# EAGLE design MosfetV5 (EAGLE 9.3.0)
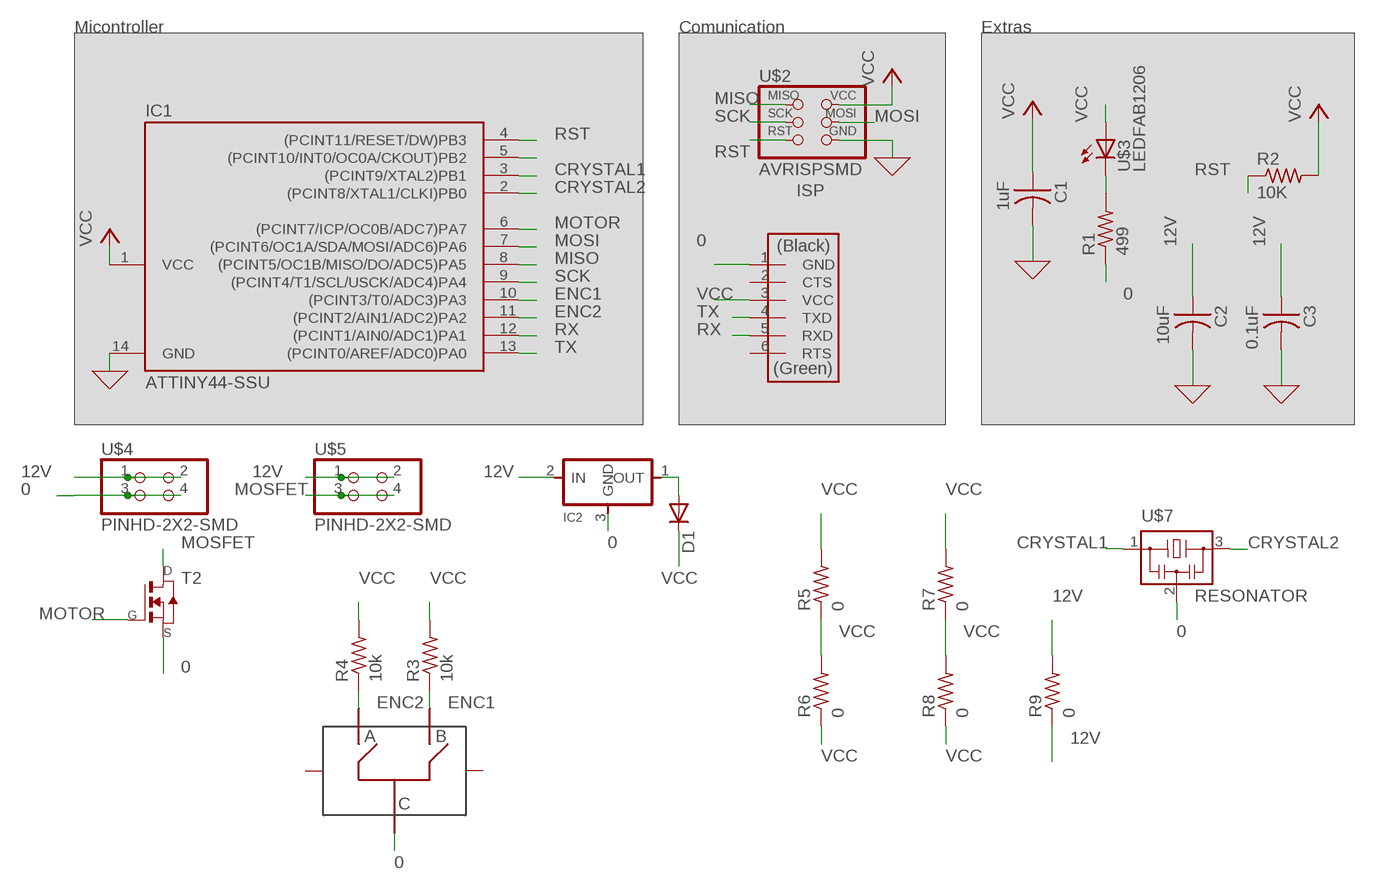
[diagram p0: schematic, sheet 1]

## Parts
C1  1uF  CAP-US1206FAB  [C1206FAB]
C2  10uF  CAP-US1206FAB  [C1206FAB]
C3  0.1uF  CAP-US1206FAB  [C1206FAB]
D1  DIODESOD123  [SOD123]
IC1  ATTINY44-SSU  [SOIC14]
IC2  REGULATORSOT23  [SOT23]
R1  499  RES-US1206FAB  [R1206FAB]
R2  10K  RES-US1206FAB  [R1206FAB]
R3  10k  RES-US1206FAB  [R1206FAB]
R4  10k  RES-US1206FAB  [R1206FAB]
R5  0  RES-US1206FAB  [R1206FAB]
R6  0  RES-US1206FAB  [R1206FAB]
R7  0  RES-US1206FAB  [R1206FAB]
R8  0  RES-US1206FAB  [R1206FAB]
R9  0  RES-US1206FAB  [R1206FAB]
T2  NMOSFETTO252  [TO252]
U$1  FTDI-SMD-HEADER  [1X06SMD]
U$2  AVRISPSMD  [2X03SMD]
U$3  LEDFAB1206  [LED1206FAB]
U$4  PINHD-2X2-SMD  [2X02SMD]
U$5  PINHD-2X2-SMD  [2X02SMD]
U$6  ALBS_ENCODER_STEC12E08  [STEC12E08]
U$7  RESONATOR  [EFOBM]

## Nets
0: C1.2 C2.2 C3.2 IC1.14(GND) IC2.3(GND) R1.1 T2.2(S) U$1.1(GND) U$2.6(GND) U$4.3 U$4.4 U$6.P$C(TERMINAL_C) U$7.2 ; supply symbol labelled GND
12V: C2.1 C3.1 IC2.2(IN) R9.1 R9.2 U$4.1 U$4.2 U$5.1 U$5.2
CRYSTAL1: IC1.3((PCINT9/XTAL2)PB1) U$7.1
CRYSTAL2: IC1.2((PCINT8/XTAL1/CLKI)PB0) U$7.3
ENC1: IC1.10((PCINT3/T0/ADC3)PA3) R3.1 U$6.P$B(TERMINAL_B)
ENC2: IC1.11((PCINT2/AIN1/ADC2)PA2) R4.1 U$6.P$A(TERMINAL_A)
MISO: IC1.8((PCINT5/OC1B/MISO/DO/ADC5)PA5) U$2.1(MISO)
MOSFET: T2.3(D) U$5.3 U$5.4
MOSI: IC1.7((PCINT6/OC1A/SDA/MOSI/ADC6)PA6) U$2.4(MOSI)
MOTOR: IC1.6((PCINT7/ICP/OC0B/ADC7)PA7) T2.1(G)
N$1: R1.2 U$3.2(C)
N$5: IC1.5((PCINT10/INT0/OC0A/CKOUT)PB2)
N$11: D1.ANODE(A) IC2.1(OUT)
RST: IC1.4((PCINT11/RESET/DW)PB3) R2.1 U$2.5(RST)
RX: IC1.12((PCINT1/AIN0/ADC1)PA1) U$1.5(RXD)
SCK: IC1.9((PCINT4/T1/SCL/USCK/ADC4)PA4) U$2.3(SCK)
TX: IC1.13((PCINT0/AREF/ADC0)PA0) U$1.4(TXD)
VCC: C1.1 D1.CATHODE(C) IC1.1(VCC) R2.2 R3.2 R4.2 R5.1 R5.2 R6.1 R6.2 R7.1 R7.2 R8.1 R8.2 U$1.3(VCC) U$2.2(VCC) U$3.1(A)
Unconnected: U$1.2(CTS) U$1.6(RTS) U$6.P$CASE0 U$6.P$CASE1

## Notes on the sheet
- Micontroller | Comunication | Extras
- ISP

## Library data of the parts
C1-C3 = fab:CAP-US
D1 = fab:DIODE: DIODE high speed (Philips)
IC1 = fab:ATTINY44
IC2 = fab:REGULATOR
R1-R9 = fab:RES-US: Resistor (US Symbol) Variants with postfix FAB are widened to allow the routing of internal traces
T2 = fab:NMOSFET: MOS FET
U$1 = fab:FTDI-SMD-HEADER
U$2 = fab:AVRISP
U$3 = fab:LED: LED
U$4 U$5 = fab:PINHD-2X2-SMD
U$6 = Rotary Encoder:ALBS_ENCODER_STEC12E08
U$7 = fab:RESONATOR

## Board
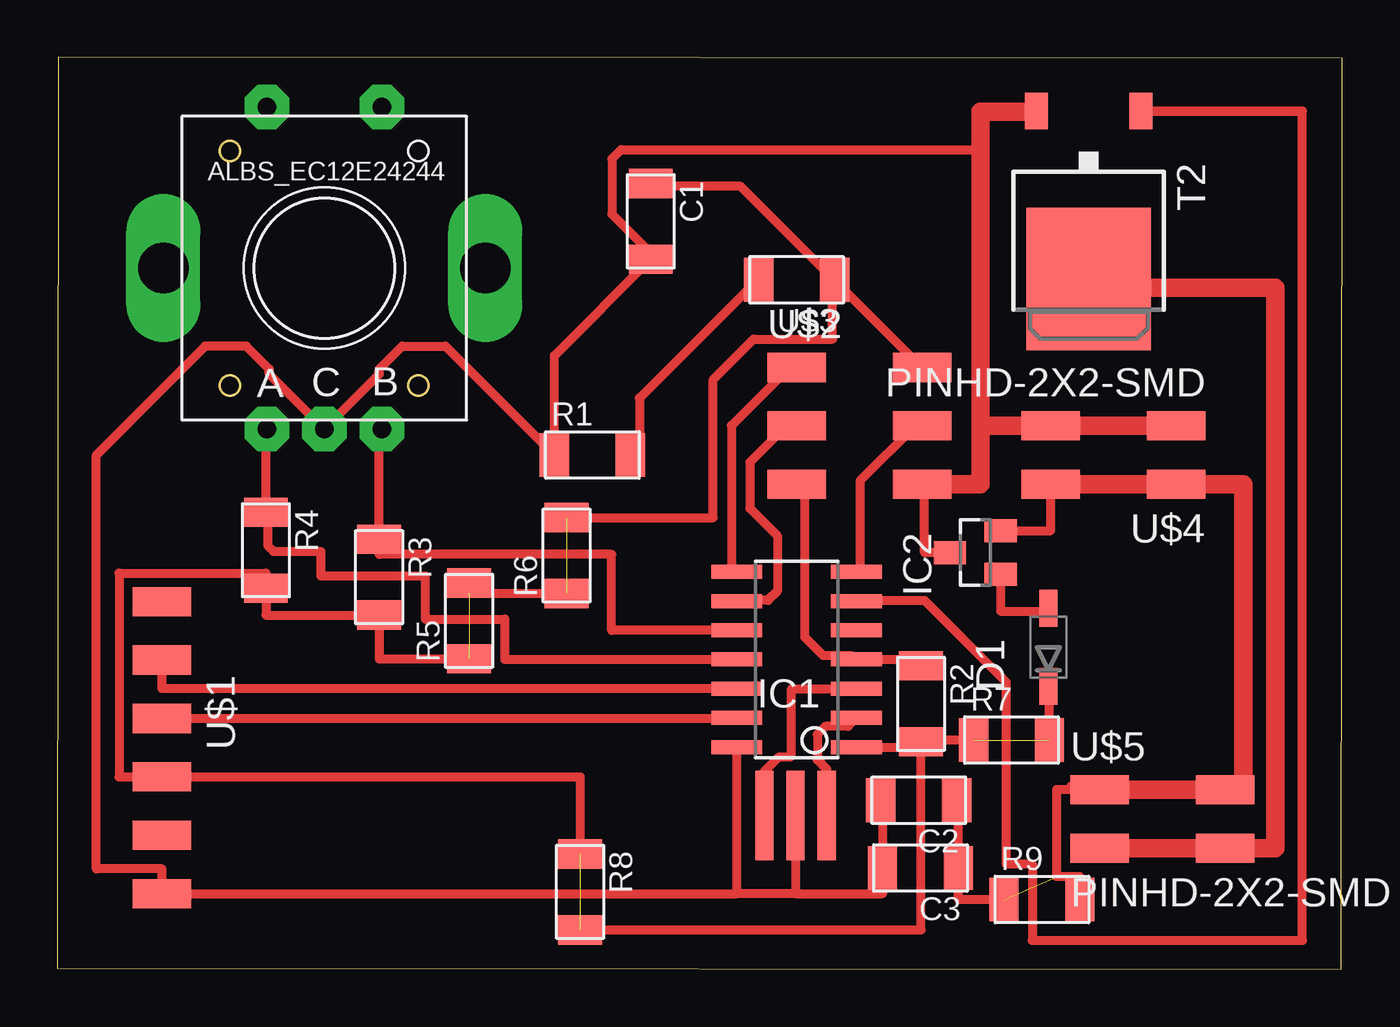
[diagram p1: board, top side]

Size 55.88 x 39.64 mm. Coordinates in mm from the lower left corner, seen from the top.
Outline: 0,0.03 55.85,0 55.88,39.61 0.03,39.64 0,0.03
Copper layers (1*16): Top 0.035mm / dielectric 1.5mm / Bottom 0.035mm
Design rules "default *": minimum track width 0.4mm, minimum drill 0.8mm, track to track 0.4mm, track to pad 0.4mm, pad to pad 0.4mm, via to via 0.4mm, smd to smd 0.4mm, copper to edge 40mil, drill to drill 6mil, minimum pad ring 10mil, minimum via ring 8mil, stop-mask expansion 4mil, vias tented up to drill 0mil, thermal gap 10mil

### Footprints (pad centres in the part's own frame; a part is rotated, then mirrored left to right if it is on the bottom)
C1206FAB = smd 1.27 x 1.905: 1 -1.651,0; 2 1.651,0
SOD123 = smd 1.6 x 0.8: ANODE 1.7,0; CATHODE -1.7,0
SOIC14 = smd 0.61 x 2.21: 1 -3.81,-2.603; 2 -2.54,-2.603; 3 -1.27,-2.603; 4 0,-2.603; 5 1.27,-2.603; 6 2.54,-2.603; 7 3.81,-2.603; 8 3.81,2.603; 9 2.54,2.603; 10 1.27,2.603; 11 0,2.603; 12 -1.27,2.603; 13 -2.54,2.603; 14 -3.81,2.603
SOT23 = smd 1 x 1.4: 1 -0.95,-1.1; 2 0.95,-1.1; 3 0,1.1
R1206FAB = smd 1.27 x 1.905: 1 -1.651,0; 2 1.651,0
TO252 = smd 1 x 1.6: 1 -2.28,-4.8; 2 2.28,-4.8 | smd 5.4 x 6.2: 3 0,2.5
1X06SMD = smd 2.54 x 1.27: 1 0,6.35; 2 0,3.81; 3 0,1.27; 4 0,-1.27; 5 0,-3.81; 6 0,-6.35
2X03SMD = smd 2.54 x 1.27: 1 -2.54,2.54; 2 2.92,2.54; 3 -2.54,0; 4 2.92,0; 5 -2.54,-2.54; 6 2.92,-2.54
LED1206FAB = smd 1.27 x 1.905: 1 -1.651,0; 2 1.651,0
2X02SMD = smd 2.54 x 1.27: 1 -2.54,1.27; 2 2.92,1.27; 3 -2.54,-1.27; 4 2.92,-1.27
STEC12E08 = drill 0.8 pad 1.93 octagon: P$A -2.5,-7; P$B 2.5,-7; P$C 0,-7; P$HOLDER0 -2.5,7; P$HOLDER1 2.5,7 | drill 2.2 long: P$CASE0 -7,0; P$CASE1 7,0
EFOBM = smd 0.8 x 3.9: 1 -1.35,0; 2 0,0; 3 1.35,0

### Placement (x,y rotation side)
C1  25.81,32.51 270 top
C2  37.46,7.34 180 top
C3  37.54,4.39 180 top
D1  43.1,14 90 top
IC1  32.16,13.46 90 top
IC2  39.93,18.11 90 top
R1  23.27,22.35 0 top
R2  37.57,11.53 270 top
R3  14,17.04 270 top
R4  9.07,18.21 270 top
R5  17.91,15.14 90 top
R6  22.15,17.98 90 top
R7  41.5,9.96 0 top
R8  22.73,3.35 270 top
R9  42.82,3.02 0 top
T2  44.86,32.51 180 top
U$1  4.55,9.63 180 top
U$2  34.7,23.62 0 top
U$3  32.16,29.97 180 top
U$4  46.13,22.35 180 top
U$5  47.88,6.53 0 top
U$6  11.61,30.48 0 top
U$7  32.11,6.68 0 top

### Tracks (layer width: path | path; a pad name or v marks a point on that pad's centre or on a via)
0
  Top 0.4: U$2.6 37.72,21.23 37.72,18.11 IC2.3 | 40.16,36.02 40.16,35.63 24.52,35.63 24.12,35.23 24.12,32.83 25.72,31.23 C1.2 21.61,26.67 R1.1 16.88,27.09 15,27.09 14,26.09 14,25.87 U$6.P$C 9.21,25.87 9.21,26.09 8.21,27.09 6.42,27.09 1.69,22.35 1.69,4.35 4.55,4.35 U$1.1 29.55,3.28 | 29.55,3.28 IC1.14 | U$7.2 32.11,3.28 | 32.11,3.28 29.55,3.28 | 32.11,3.28 35.89,3.28 C3.2 35.89,7.34 C2.2
  Top 0.813: 40.16,23.62 U$4.4 U$4.3 | 40.16,23.62 40.16,36.02 40.16,37.29 42.58,37.29 T2.2 | U$2.6 40.16,21.08 40.16,23.62
12V  (1 unrouted)
  Top 0.4: 48.52,21.23 U$4.1 | 44.09,7.96 45.25,7.81 | 45.25,7.81 U$5.1 | IC2.2 43.21,19.06 U$4.2 | C2.1 39.19,7.34 C3.1 39.19,3.02 R9.1 | R9.2 44.48,4.02 43.47,4.02 43.47,7.81 45.25,7.81
  Top 0.813: U$4.1 51.59,21.08 51.59,7.82 50.8,7.82 U$5.2 | U$4.2 48.52,21.08 48.52,21.23 | U$5.2 50.78,7.78 | U$5.2 45.25,7.8 45.25,7.81
CRYSTAL1
  Top 0.4: U$7.1 30.76,8.6 31.39,9.23 31.88,9.23 31.93,9.28 31.93,12.17 31.95,12.19 IC1.3 34.68,12.27
CRYSTAL2
  Top 0.4: IC1.2 34.4,10.56 33.41,10.56 33.05,10.21 33.05,9.1 33.46,8.7 U$7.3
ENC1
  Top 0.4: IC1.10 24.11,14.73 24.11,18.03 13.99,18.03 R3.1 13.99,23.48 U$6.P$B
ENC2
  Top 0.4: IC1.11 19.46,13.46 19.46,15.21 16,15.21 16,17.09 11.46,17.09 11.46,18.16 9.4,18.16 9.14,18.41 9.14,19.79 R4.1 9.07,23.48 U$6.P$A
MISO
  Top 0.4: IC1.8 29.32,17.23 29.32,23.63 32.12,26.43 U$2.1
MOSFET
  Top 0.4: 44.92,29.63 T2.3
  Top 0.813: U$5.3 U$5.4 52.98,5.26 52.98,29.63 44.92,29.63
MOSI
  Top 0.4: IC1.7 34.92,17.23 34.92,21.23 37.32,23.63 U$2.4
MOTOR
  Top 0.4: IC1.6 34.92,16.03 37.72,16.03 41.26,12.49 41.26,4.57 42.41,4.57 42.41,1.24 54.15,1.24 54.15,37.31
  Top 0.406: 54.15,37.31 T2.1
N$1
  Top 0.4: R1.2 25.32,22.43 25.32,24.83 30.12,29.63 U$3.2
N$11
  Top 0.4: IC2.1 41.03,15.57 43.1,15.57 D1.ANODE
RST
  Top 0.4: U$2.5 32.52,20.83 32.52,14.43 33.32,13.63 34.52,13.63 IC1.4 37.57,13.46 R2.1
RX
  Top 0.4: IC1.12 4.55,12.19 U$1.5
SCK
  Top 0.4: IC1.9 29.72,16.03 30.92,16.03 31.32,16.43 31.32,18.83 30.12,20.03 30.12,22.03 31.32,23.23 32.12,23.23 U$2.3
TX
  Top 0.4: 4.55,10.92 U$1.4 29.55,10.9 IC1.13
VCC  (4 unrouted)
  Top 0.4: 33.72,30.03 29.72,34.03 26.12,34.03 C1.1 | 33.72,30.03 U$3.1 34.12,29.63 37.32,26.43 U$2.2 | 37.2,10.04 R2.2 | 34.92,9.63 IC1.1 37.57,9.65 | 37.57,9.65 R2.2 | 43.18,12.3 D1.CATHODE 43.16,12.3 R7.2 | 33.72,30.03 33.72,27.4 30.29,27.4 28.52,25.63 28.52,19.63 R6.2 | R5.1 13.99,13.49 R3.2 9.07,15.39 R4.2 9.07,17.21 2.68,17.21 2.68,8.36 U$1.3 22.73,8.36 R8.1 | R5.2 17.91,16.33 R6.1 | R7.1 37.57,9.96 R2.2 | R8.2 37.57,1.7 37.57,9.65